# EAGLE design J006330_DualLickCompREVC (EAGLE 7.7.0)
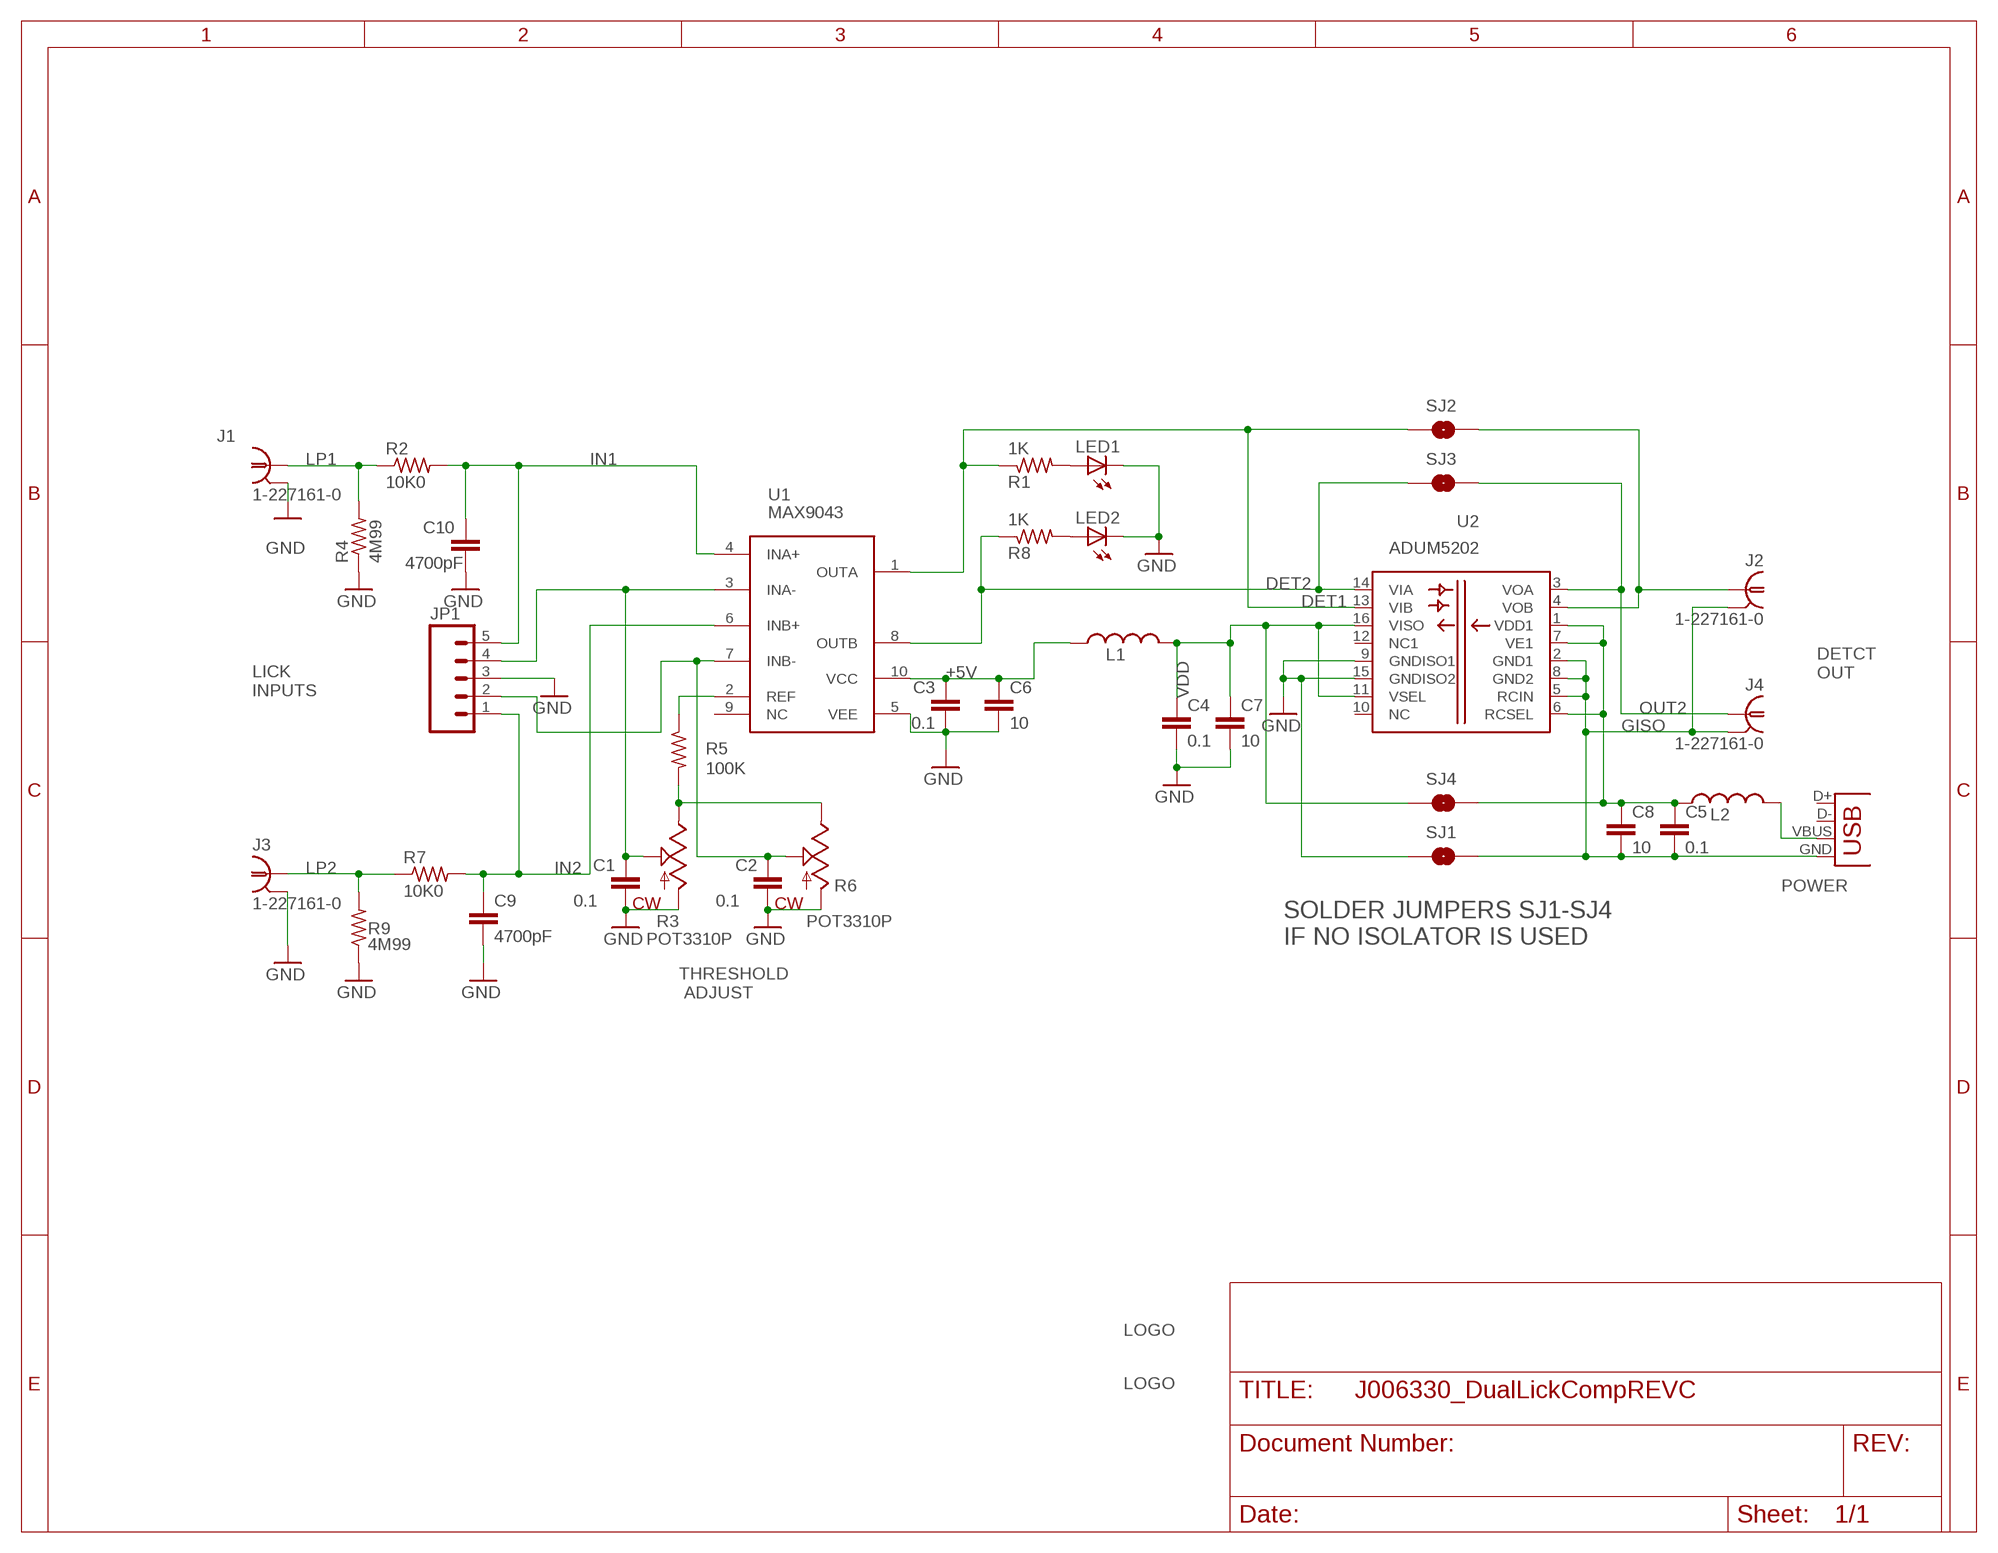
[diagram p0: schematic, sheet 1]

## Parts
C1  0.1  CAPS0603S  [0603S]
C2  0.1  CAPS0603S  [0603S]
C3  0.1  CAPS0603S  [0603S]
C4  0.1  CAPS0603S  [0603S]
C5  0.1  CAPS0603S  [0603S]
C6  10  CAPS0805S  [0805S]
C7  10  CAPS0805S  [0805S]
C8  10  CAPS0805S  [0805S]
C9  4700pF  CAPS0805S  [0805S]
C10  4700pF  CAPS0805S  [0805S]
J1  1-227161-0  [AMP_227161]
J2  1-227161-0  [AMP_227161]
J3  1-227161-0  [AMP_227161]
J4  1-227161-0  [AMP_227161]
J100  USB  [10118194]
JP1  M05LOCK  [1X05_LOCK]
L1  INDUCTOR_SM0805S  [0805S]
L2  INDUCTOR_SM0805S  [0805S]
LED1  LED5MM  [LED5MM]
LED2  LED5MM  [LED5MM]
R1  1K  RESISTOR_SM0805S  [0805S]
R2  10K0  RESISTOR_SM0805S  [0805S]
R3  POT3310P  [3310P]
R4  4M99  RESISTOR_SM0805S  [0805S]
R5  100K  RESISTOR_SM0805S  [0805S]
R6  POT3310P  [3310P]
R7  10K0  RESISTOR_SM0805S  [0805S]
R8  1K  RESISTOR_SM0805S  [0805S]
R9  4M99  RESISTOR_SM0805S  [0805S]
SJ1  SOLDERJUMPERNO  [SJ_2S-NO]
SJ2  SOLDERJUMPERNO  [SJ_2S-NO]
SJ3  SOLDERJUMPERNO  [SJ_2S-NO]
SJ4  SOLDERJUMPERNO  [SJ_2S-NO]
U1  MAX9043  [UMAX10]
U2  ADUM5202  [SO-16-7.5MM]
U$1  JFRC-LOGOLOGO_OP  [LOGO_BMP_OP]
U$2  JFRC-LOGOLOGO_JANELIA_2014_ECLOSURE  [LOGO_JANELIA_2014_ENCLOSURE]

## Nets
+5V: C3.1 C6.1 L1.1 U1.10(VCC)
DET1: R1.1 SJ2.1 U1.1(OUTA) U2.13(VIB)
DET2: R8.1 SJ3.1 U1.8(OUTB) U2.14(VIA)
GISO: C5.2 C8.2 J2.2 J4.2 J100.GND SJ1.2 U2.2(GND1) U2.5(RCIN) U2.8(GND2)
GND: C1.2 C2.2 C3.2 C4.2 C6.2 C7.2 C9.2 C10.2 J1.2 J3.2 JP1.3 LED1.K(C) LED2.K(C) R3.1(CCW) R4.1 R6.1(CCW) R9.1 SJ1.1 U1.5(VEE) U2.9(GNDISO1) U2.15(GNDISO2)
IN1: C10.1 JP1.5 R2.2 U1.4(INA+)
IN2: C9.1 JP1.1 R7.2 U1.6(INB+)
LP1: J1.1 R2.1 R4.2
LP2: J3.1 R7.1 R9.2
N$1: J2.1 SJ2.2 U2.4(VOB)
N$2: LED1.A R1.2
N$3: R5.1 U1.2(REF)
N$4: R3.3(CW) R5.2 R6.3(CW)
N$5: C1.1 JP1.4 R3.2(W) U1.3(INA-)
N$6: LED2.A R8.2
N$7: J100.VBUS L2.2
N$9: C2.1 JP1.2 R6.2(W) U1.7(INB-)
OUT2: J4.1 SJ3.2 U2.3(VOA)
VDD: C4.1 C7.1 L1.2 SJ4.1 U2.11(VSEL) U2.16(VISO)
VIN: C5.1 C8.1 L2.1 SJ4.2 U2.1(VDD1) U2.6(RCSEL) U2.7(VE1)
Unconnected: J100.D+ J100.D- U1.9(NC) U2.10(NC) U2.12(NC1)

## Notes on the sheet
- DETCT 
  OUT
- LICK 
  INPUTS
- POWER
- SOLDER JUMPERS SJ1-SJ4
  IF NO ISOLATOR IS USED
- THRESHOLD
   ADJUST

## Library data of the parts
C1-C10 = STEVES_BU:CAPS
J1-J4 = con-coax:?227161*: JACK, RIGHT ANGLE, 50 OHM, PCB, BNC Source: amp_227161.pdf; MF: TYCO ELECTRONICS; MPN: 1-227161; OC_FARNELL: unknown; OC_NEWARK: 33B3200
J100 = SparkFun:USB: USB Connectors USB-B-PTH is fully proven SKU : PRT-00139 USB-miniB is fully proven SKU : PRT-00587 USB-A-PCB is untested. USB-A-H is throughly reviewed, but untested. Spark Fun Electronics SKU : PRT-00437 USB-B-SMT is throughly reviewed, but untested. Needs silkscreen touching up. USB-A-S has not been used/tested USB-MB-H has not been used/tested
JP1 = SparkFun:M05: Header 5 Standard 5-pin 0.1" header. Use with straight break away headers (SKU : PRT-00116), right angle break away headers (PRT-00553), swiss pins (PRT-00743), machine pins (PRT-00117), and female headers (PRT-00115). Molex polarized connector foot print use with SKU : PRT-08230 with associated crimp pins and housings.
L1 L2 = STEVES_BU:INDUCTOR_SM
LED1 LED2 = led:LED: LED OSRAM: - CHIPLED LG R971, LG N971, LY N971, LG Q971, LY Q971, LO R971, LY R971 LH N974, LH R974 LS Q976, LO Q976, LY Q976 LO Q996 - Hyper CHIPLED LW Q18S LB Q993, LB Q99A, LB R99A - SideLED LS A670, LO A670, LY A670, LG A670, LP A670 LB A673, LV A673, LT A673, LW A673 LH A674 LY A675 LS A676, LA A676, LO A676, LY A676, LW A676 LS A679, LY A679, LG A679 - Hyper Micro SIDELED® LS Y876, LA Y876, LO Y876, LY Y876 LT Y87S - SmartLED LW L88C, LW L88S LB L89C, LB L89S, LG L890 LS L89K, LO L89K, LY L89K LS L896, LA L896, LO L896, LY L896 - TOPLED LS T670, LO T670, LY T670, LG T670, LP T670 LSG T670, LSP T670, LSY T670, LOP T670, LYG T670 LG T671, LOG T671, LSG T671 LB T673, LV T673, LT T673, LW T673 LH T674 LS T676, LA T676, LO T676, LY T676, LB T676, LH T676, LSB T676, LW T676 LB T67C, LV T67C, LT T67C, LS T67K, LO T67K, LY T67K, LW E67C LS E67B, LA E67B, LO E67B, LY E67B, LB E67C, LV E67C, LT E67C LW T67C LS T679, LY T679, LG T679 LS T770, LO T770, LY T770, LG T770, LP T770 LB T773, LV T773, LT T773, LW T773 LH T774 LS E675, LA E675, LY E675, LS T675 LS T776, LA T776, LO T776, LY T776, LB T776 LHGB T686 LT T68C, LB T68C - Hyper Mini TOPLED® LB M676 - Mini TOPLED Santana® LG M470 LS M47K, LO M47K, LY M47K Source: http://www.osram.convergy.de LUXEON: - LUMILED® LXK2-PW12-R00, LXK2-PW12-S00, LXK2-PW14-U00, LXK2-PW14-V00 LXK2-PM12-R00, LXK2-PM12-S00, LXK2-PM14-U00 LXK2-PE12-Q00, LXK2-PE12-R00, LXK2-PE12-S00, LXK2-PE14-T00, LXK2-PE14-U00 LXK2-PB12-K00, LXK2-PB12-L00, LXK2-PB12-M00, LXK2-PB14-N00, LXK2-PB14-P00, LXK2-PB14-Q00 LXK2-PR12-L00, LXK2-PR12-M00, LXK2-PR14-Q00, LXK2-PR14-R00 LXK2-PD12-Q00, LXK2-PD12-R00, LXK2-PD12-S00 LXK2-PH12-R00, LXK2-PH12-S00 LXK2-PL12-P00, LXK2-PL12-Q00, LXK2-PL12-R00 Source: www.luxeon.com KINGBRIGHT: KA-3528ASYC Source: www.kingbright.com
R1 R2 R4 R5 R7-R9 = STEVES_BU:RESISTOR_SM
R3 R6 = STEVES_BU:POT
SJ1-SJ4 = SparkFun:SOLDERJUMPER: Solder Jumper Standard SMD solder jumper. Used to automate production. Two varients : Normally Open and Normally Closed are the same, but have different paste layers. NC will have a large amount of paste and should jumper during reflow.
U1 = STEVES_BU:MAX9043
U2 = STEVES_BU:ADUM5202
U$1 U$2 = STEVES_BU:JFRC-LOGO

## Board
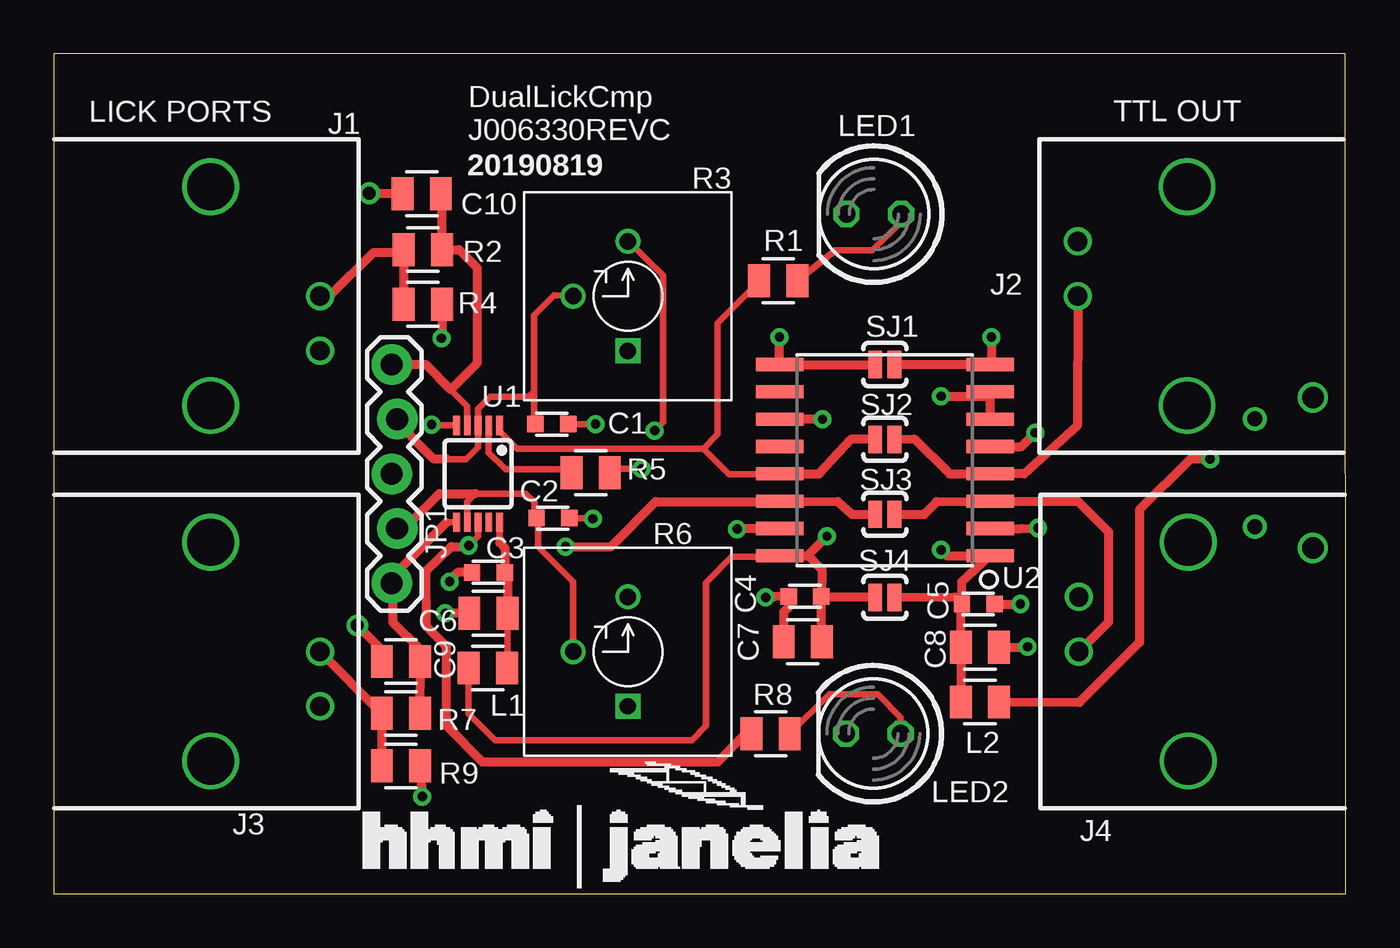
[diagram p1: board, top side]
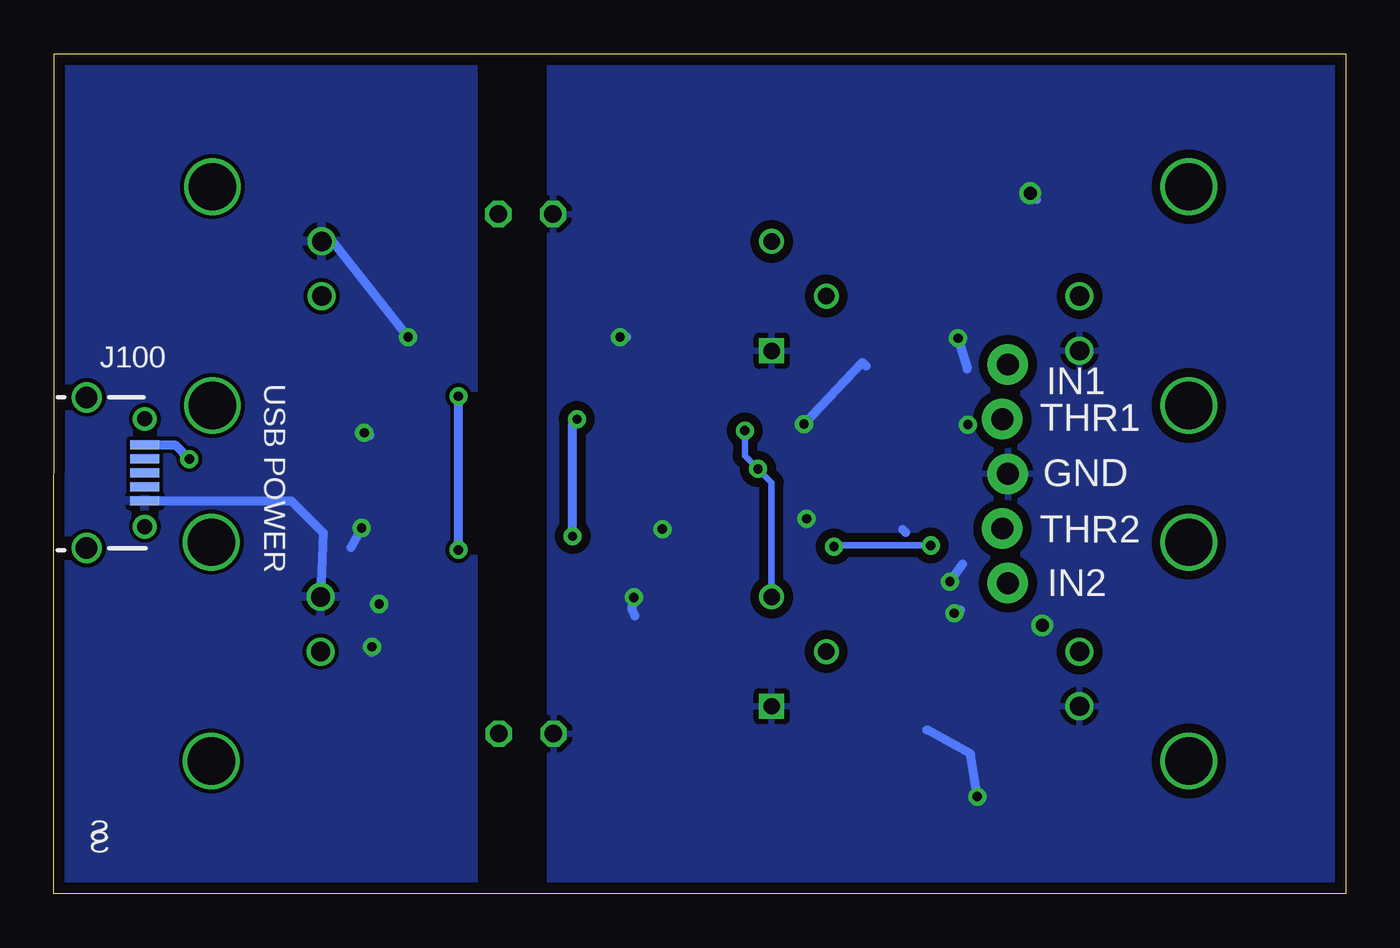
[diagram p2: board, bottom side, seen from below]

Size 60.02 x 39.01 mm. Coordinates in mm from the lower left corner, seen from the top.
Outline: 0,0 60.02,0 59.99,39.01 0,39.01 0,0
Copper layers (1*16): Top 0.035mm / dielectric 1.5mm / Bottom 0.035mm
Design rules "default *": minimum track width 10mil, minimum drill 17mil, track to track 7mil, track to pad 7mil, pad to pad 7mil, via to via 8mil, smd to smd 7mil, copper to edge 20mil, drill to drill 8mil, minimum pad ring 8mil, minimum via ring 8mil, stop-mask expansion 4mil, vias tented up to drill 25mil, thermal gap 10mil

### Footprints (pad centres in the part's own frame; a part is rotated, then mirrored left to right if it is on the bottom)
0603S = smd 0.762 x 0.762: 1 -0.762,0; 2 0.762,0
0805S = smd 1.016 x 1.524: 1 -0.889,0; 2 0.889,0
AMP_227161 = drill 0.9 pad 1.27: 1 0,-5.08; 2 -2.54,-5.08 | drill 2.2: 3 -5.08,0; 4 5.08,0
10118194 = drill 1: A -3.5,1.45; D 3.5,1.45 | drill 0.7: B -2.5,4.15; C 2.5,4.15 | smd 0.4 x 1.35: D+ 0,4.15; D- -0.65,4.15; GND 1.3,4.15; ID 0.65,4.15; VBUS -1.3,4.15
1X05_LOCK = drill 1.016 pad 1.88: 1 0,0.127; 2 2.54,-0.127; 3 5.08,0.127; 4 7.62,-0.127; 5 10.16,0.127
LED5MM = drill 0.813 octagon: A -1.27,0; K 1.27,0
3310P = drill 0.762 square: 1 0,2.54 | drill 0.762: 2 2.54,0; 3 0,-2.54
SJ_2S-NO = smd 0.635 x 1.27: 1 -0.45,0; 2 0.45,0
UMAX10 = smd 0.32 x 0.9: 1 -1,-2.25; 2 -0.5,-2.25; 3 0,-2.25; 4 0.5,-2.25; 5 1,-2.25; 6 1,2.25; 7 0.5,2.25; 8 0,2.25; 9 -0.5,2.25; 10 -1,2.25
SO-16-7.5MM = smd 0.61 x 2.21: 1 -3.81,-4.889; 2 -2.54,-4.889; 3 -1.27,-4.889; 4 0,-4.889; 5 1.27,-4.889; 6 2.54,-4.889; 7 3.81,-4.889; 8 5.08,-4.889; 9 5.08,4.889; 10 3.81,4.889; 11 2.54,4.889; 12 1.27,4.889; 13 0,4.889; 14 -1.27,4.889; 15 -2.54,4.889; 16 -3.81,4.889

### Placement (x,y rotation side)
C1  23.14,21.82 0 top
C2  23.19,17.45 0 top
C3  20.19,14.94 180 top
C4  34.9,13.82 180 top
C5  42.95,13.46 0 top
C6  20.19,13.03 180 top
C7  34.8,11.71 180 top
C8  43.03,11.46 0 top
C9  16.13,10.79 180 top
C10  17.09,32.51 180 top
J1  7.29,27.76 90 top
J2  52.65,27.76 270 top
J3  7.29,11.25 90 top
J4  52.7,11.25 270 top
J100  59.94,19.56 270 bottom
JP1  15.82,14.43 90 top
L1  20.17,10.49 180 top
L2  43.03,8.92 0 top
LED1  38.1,31.57 180 top
LED2  38.07,7.44 180 top
R1  33.66,28.47 0 top
R2  17.14,29.92 0 top
R3  26.67,27.76 180 top
R4  17.14,27.38 180 top
R5  24.94,19.56 0 top
R6  26.67,11.25 180 top
R7  16.13,8.38 0 top
R8  33.3,7.44 0 top
R9  16.13,5.94 180 top
SJ1  38.61,24.59 0 top
SJ2  38.61,21.11 0 top
SJ3  38.61,17.63 0 top
SJ4  38.61,13.77 0 top
U1  19.71,19.51 180 top
U2  38.61,19.51 90 top
U$1  24.51,1.7 0 top
U$2  -21.72,-18.67 0 top  (outside the outline)

### Tracks (layer width: path | path; a pad name or v marks a point on that pad's centre or on a via)
+5V
  Top 0.305: U1.10 20.71,16.48 20.73,16.46 | C6.1 21.08,10.52 L1.1
  Top 0.406: 20.73,16.46 20.73,16.31 20.95,16.05 C3.1 20.9,14.96 21.08,14.78 C6.1
DET1
  Top 0.305: U1.1 20.71,21.48 21.51,20.68 30.18,20.68 | 30.18,20.68 31.37,19.48 33.69,19.48 U2.13 | R1.1 32.54,28.19 30.84,26.49 30.84,21.34 30.18,20.68
  Top 0.406: U2.13 35.56,19.51 37.06,21.13 38.28,21.13 SJ2.1
DET2  (via drill 0.43)
  Top 0.305: U1.8 19.71,16.61 v19.28,16.18
  Top 0.406: v23.77,16.13 25.88,16.13 27.96,18.21 33.69,18.21 U2.14 36.42,18.21 37.08,17.63 SJ3.1 | R8.1 32.03,7.32 30.84,6.12 19.91,6.12 18.24,7.8 18.24,11.48 17.3,12.42 17.27,14.99 18.47,16.13 19.23,16.13 v19.28,16.18
  Bottom 0.305: v19.28,16.18 23.72,16.18 v23.77,16.13
GISO  (via drill 0.43)
  Top 0.406: U2.2 44.96,16.97 v45.72,16.99 | v43.56,25.86 43.56,24.65 U2.8 SJ1.2 | C5.2 v44.91,13.46 | U2.5 44.96,20.78 v45.59,21.41 | C8.2 45.21,11.46 v45.24,11.48
  Bottom 0.406: v45.72,16.99 46.23,16.08 | J100.GND 48.99,18.26 47.5,16.76 J4.2 | J2.2 47.12,30.35 v43.56,25.86 | v45.59,21.41 45.47,21.41 45.34,21.29 | v45.24,11.48 45.24,11.23 45.26,11.2
  pour Bottom: 40.51,41.68 62.74,41.66 62.74,-4.95 40.51,-5.13
GND  (via drill 0.43, 0.6)
  Top 0.305: U1.5 17.71,21.76 17.68,21.79 | C2.2 25.02,17.45 v25.04,17.42 | C1.2 v25.17,21.82
  Top 0.406: 17.68,21.79 v17.55,21.79 | C3.2 18.77,14.94 18.39,14.55 v18.39,14.5 | C6.2 v18.19,13.03 | v33.07,13.77 33.43,13.79 C4.2 34.14,13.31 33.91,13.08 C7.2 | v33.72,25.86 U2.9 33.74,24.56 38.1,24.56 SJ1.1 | R9.1 v17.12,4.52 | U2.15 31.77,16.97 v31.75,16.94 | R4.1 18.03,25.78 v18.01,25.81 | C9.2 15.11,11.46 v14.1,12.47 | C10.2 14.68,32.51 v14.66,32.54
  Bottom 0.305: v25.04,17.42 25.04,17.14 25.07,17.12
  Bottom 0.406: v17.55,21.79 17.55,21.67 | v18.39,14.5 17.8,15.32 | v18.19,13.03 17.88,13.18 | 20.57,16.92 20.45,16.79 | v33.07,13.77 33.17,13.23 33.02,12.9 | v33.72,25.86 33.4,25.86 | v17.12,4.52 17.42,6.5 19.46,7.62 | v31.75,16.94 31.75,16.84 | v18.01,25.81 17.58,24.38 | v25.17,21.82 22.45,24.69 22.28,24.51 | v14.1,12.47 13.92,12.47 13.79,12.6 | v14.66,32.54 14.63,32.54 14.35,32.26
  pour Bottom (isolate 0.406): -3.17,41.66 -2.79,-1.52 36.96,-0.94 36.96,41.78
IN1
  Top 0.305: U1.4 19.21,22.65 18.44,23.42
  Top 0.406: JP1.5 17.27,24.59 18.44,23.42 19.66,24.64 19.66,29.08 18.82,29.92 R2.2 18.03,32.46 C10.1
IN2
  Top 0.305: U1.6 18.25,17.26
  Top 0.406: R7.2 17.04,10.64 16.97,10.85 | 16.97,10.85 16.97,11.4 15.75,12.62 15.75,14.43 | 18.25,17.26 15.75,14.76 15.75,14.43 | JP1.1 15.75,14.43 | C9.1 16.97,10.85
LP1
  Top 0.406: J1.1 12.78,27.74 14.86,29.79 16.13,29.79 R2.1 R4.2
LP2
  Top 0.406: R9.2 R7.1 15.14,8.46 J3.1
N$1
  Top 0.406: J2.1 47.55,21.74 45.09,19.51 U2.4 41.63,19.51 39.98,21.13 SJ2.2
N$2
  Top 0.305: LED1.A 39.37,31.22 38.02,29.9 36.32,29.9 R1.2
N$3
  Top 0.305: U1.2 20.21,20.48 20.98,19.71 23.9,19.71 R5.1
N$4  (via drill 0.43)
  Top 0.305: R3.3 28.3,28.73 28.3,21.89 v27.91,21.51 | v27.3,19.74 26.01,19.74 R5.2
  Bottom 0.305: v27.91,21.51 27.91,20.34 v27.3,19.74 26.67,19.1 R6.3
N$5
  Top 0.305: R3.2 23.24,27.81 22.3,26.87 22.3,23.34 | 22.3,23.34 22.3,21.89 C1.1 | 22.3,23.34 22.05,23.09 20.27,23.09 19.71,22.53 U1.3 19.71,20.75 19.15,20.19 18.24,20.19 18.21,20.22
  Top 0.406: JP1.4 15.95,21.89 17.63,20.22 18.21,20.22
N$6
  Top 0.305: LED2.A 39.34,8.2 38.28,9.27 36.04,9.27 R8.2
N$7  (via drill 0.43)
  Top 0.406: L2.2 47.65,8.89 50.44,11.68 50.44,17.83 52.81,20.19 v53.72,20.19
  Bottom 0.406: J100.VBUS 54.39,20.86 v53.72,20.19
N$9
  Top 0.305: U1.7 19.21,18.22 19.58,18.59 21.92,18.59 22.33,18.19 22.33,17.55 C2.1 22.5,17.37 22.5,16.13 24.13,14.5 R6.2
  Top 0.406: JP1.2 16.28,16.97 17.91,18.59 19.58,18.59
OUT2
  Top 0.406: J4.1 49,12.62 49,16.82 47.57,18.24 U2.3 41.02,18.21 40.44,17.63 SJ3.2
VDD  (via drill 0.43)
  Top 0.305: L1.2 19.28,8.36 20.5,7.14 29.64,7.14 30.3,7.8 30.3,14.45 31.5,15.65 33.67,15.65 U2.16
  Top 0.406: C4.1 35.66,13.31 C7.1 35.69,12.09 | U2.16 35.05,15.7 | 35.05,15.7 35.69,15.06 C4.1 | 35.05,15.7 35.05,15.75 v35.92,16.61 | v35.71,22.05 U2.11 | SJ4.1 35.71,13.77 C4.1
  Bottom 0.406: v35.92,16.61 35.92,21.84 v35.71,22.05
VIN  (via drill 0.43)
  Top 0.406: U2.6 U2.7 43.29,23.11 v41.22,23.11 | 42.55,15.7 41.5,15.7 v41.22,15.98 | 42.55,15.7 U2.1 42.19,14.49 C5.1 | 42.67,15.57 42.55,15.7 | C8.1 42.14,13.41 C5.1 | C8.1 L2.1 | 42.14,12.12 C8.1 | SJ4.2 41.86,13.79 C5.1
  Bottom 0.406: v41.22,15.98 v41.22,23.11

### Text on the board
tPlace: LICK PORTS | TTL OUT | DualLickCmp / J006330REVC | 20190819
bPlace: USB POWER | IN1 | THR1 | GND | THR2 | IN2 | S | S